# EAGLE design BMS Cell Charging Adapter rev2 (EAGLE 9.6.2)
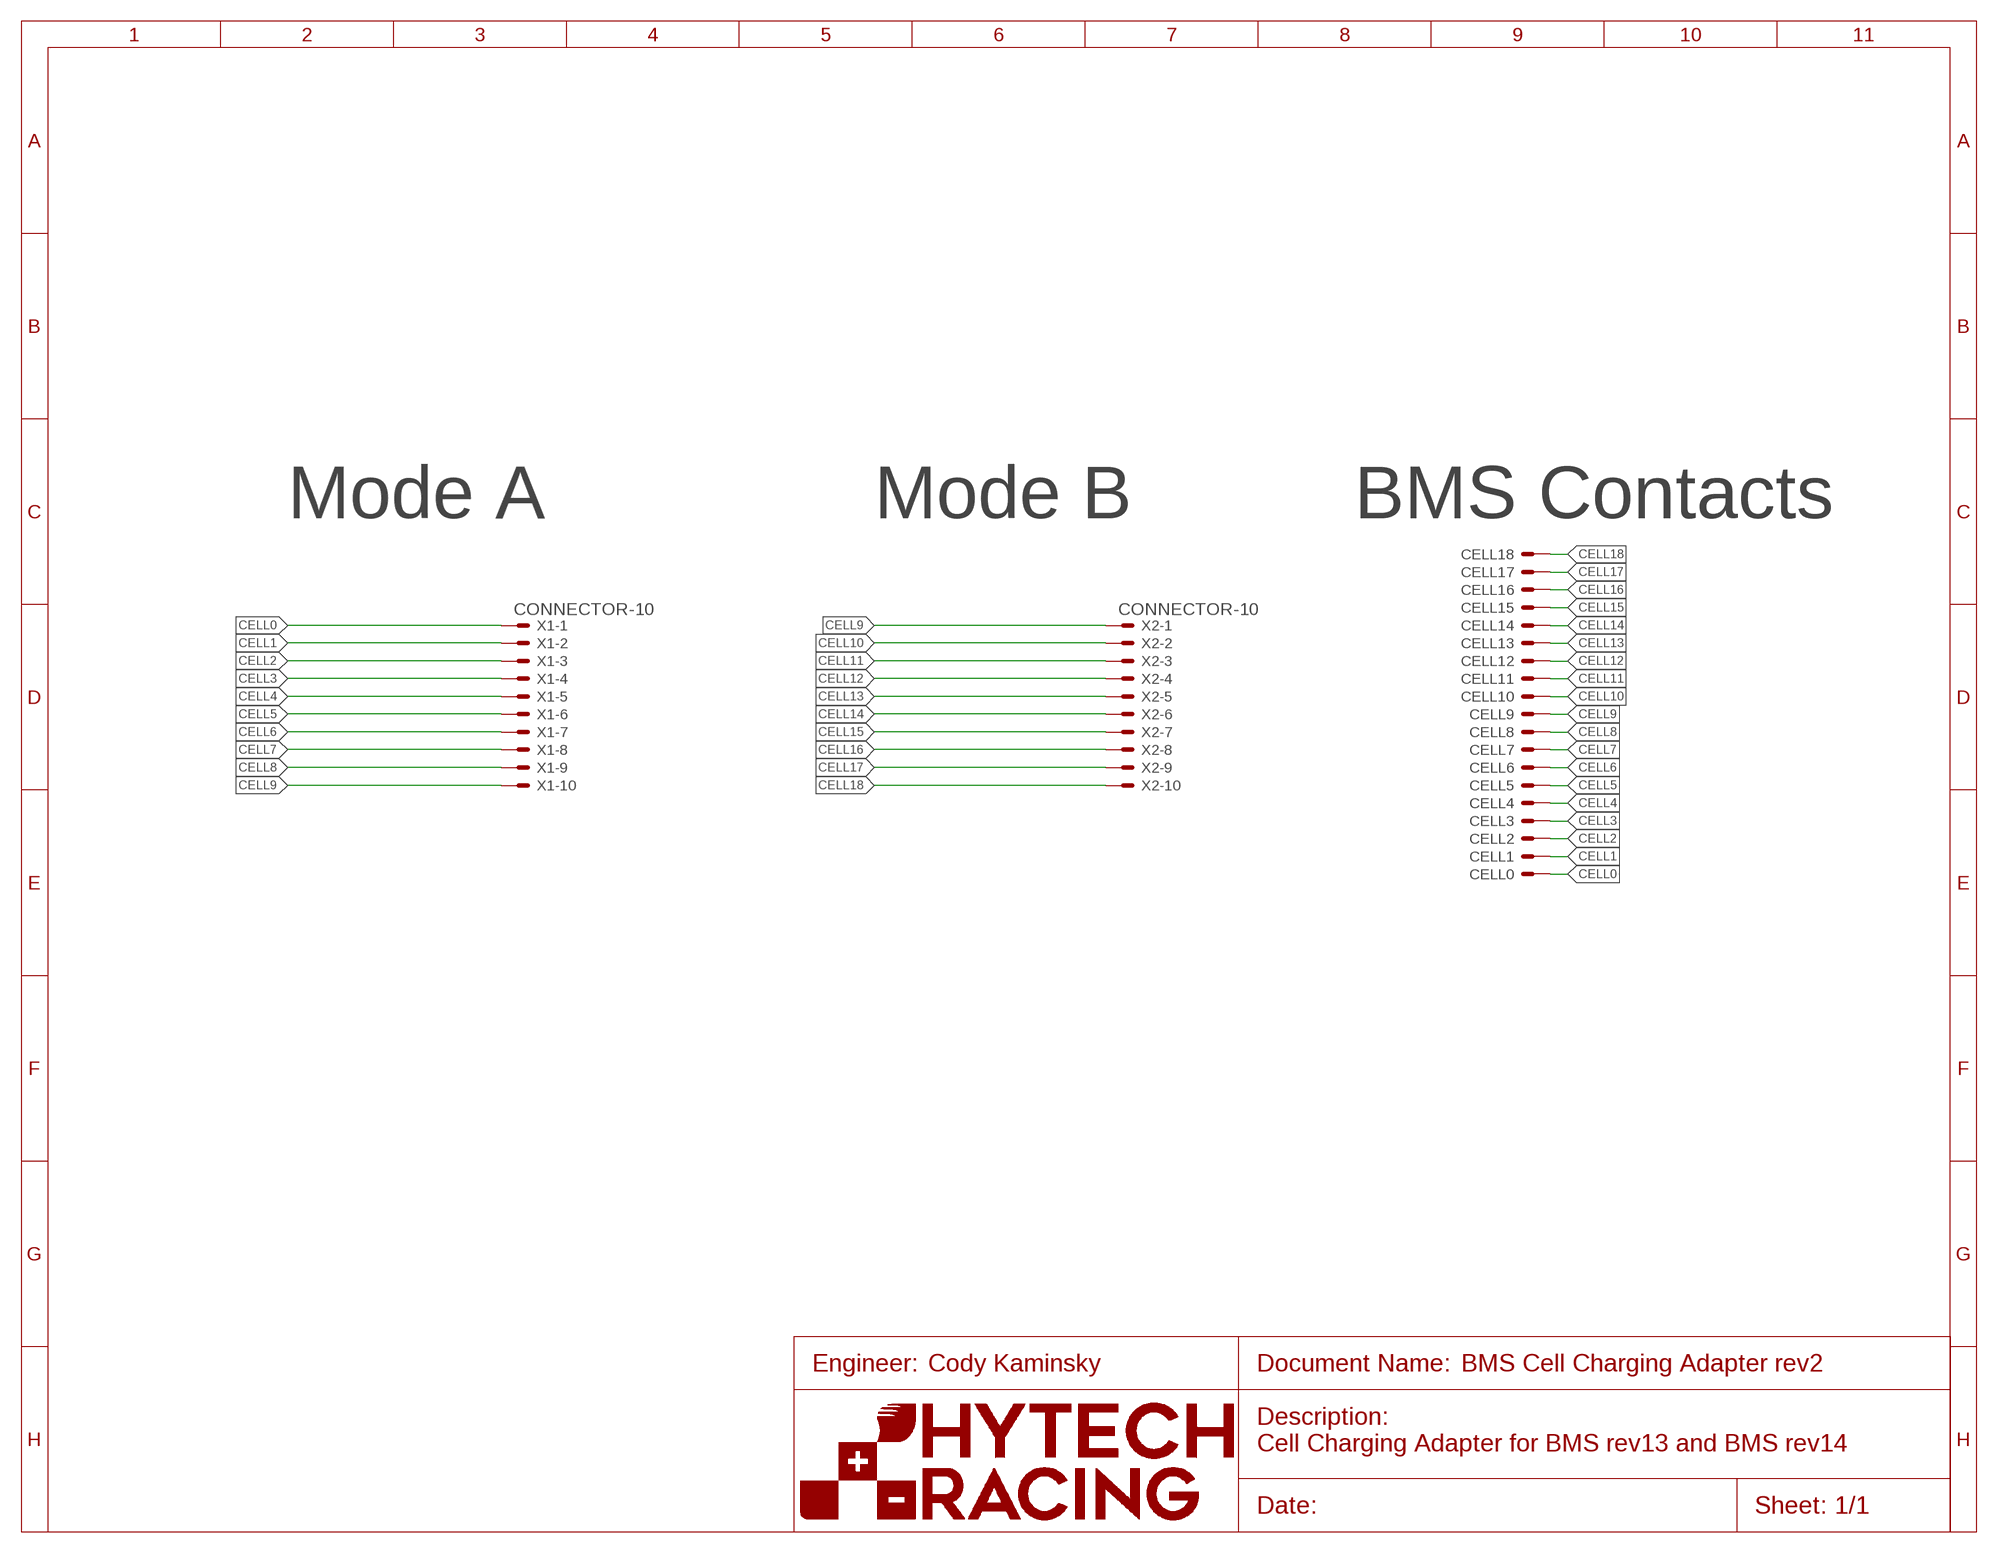
[diagram p0: schematic, sheet 1]
U$1 (FRAME_A): FRAME_DESCRIPTION: Default; ORIENTATION: LANDSCAPE; SIZE: A

## Parts
CELL0  BATTERY_SPRING_KEYSTONE5222  [KEYSTONE5222]
CELL1  BATTERY_SPRING_KEYSTONE5222  [KEYSTONE5222]
CELL2  BATTERY_SPRING_KEYSTONE5222  [KEYSTONE5222]
CELL3  BATTERY_SPRING_KEYSTONE5222  [KEYSTONE5222]
CELL4  BATTERY_SPRING_KEYSTONE5222  [KEYSTONE5222]
CELL5  BATTERY_SPRING_KEYSTONE5222  [KEYSTONE5222]
CELL6  BATTERY_SPRING_KEYSTONE5222  [KEYSTONE5222]
CELL7  BATTERY_SPRING_KEYSTONE5222  [KEYSTONE5222]
CELL8  BATTERY_SPRING_KEYSTONE5222  [KEYSTONE5222]
CELL9  BATTERY_SPRING_KEYSTONE5222  [KEYSTONE5222]
CELL10  BATTERY_SPRING_KEYSTONE5222  [KEYSTONE5222]
CELL11  BATTERY_SPRING_KEYSTONE5222  [KEYSTONE5222]
CELL12  BATTERY_SPRING_KEYSTONE5222  [KEYSTONE5222]
CELL13  BATTERY_SPRING_KEYSTONE5222  [KEYSTONE5222]
CELL14  BATTERY_SPRING_KEYSTONE5222  [KEYSTONE5222]
CELL15  BATTERY_SPRING_KEYSTONE5222  [KEYSTONE5222]
CELL16  BATTERY_SPRING_KEYSTONE5222  [KEYSTONE5222]
CELL17  BATTERY_SPRING_KEYSTONE5222  [KEYSTONE5222]
CELL18  BATTERY_SPRING_KEYSTONE5222  [KEYSTONE5222]
X1  CONNECTOR-10  [MINIFIT_5566-10]
X2  CONNECTOR-10  [MINIFIT_5566-10]

## Nets
CELL0: CELL0.P$1(S) X1.1
CELL1: CELL1.P$1(S) X1.2
CELL2: CELL2.P$1(S) X1.3
CELL3: CELL3.P$1(S) X1.4
CELL4: CELL4.P$1(S) X1.5
CELL5: CELL5.P$1(S) X1.6
CELL6: CELL6.P$1(S) X1.7
CELL7: CELL7.P$1(S) X1.8
CELL8: CELL8.P$1(S) X1.9
CELL9: CELL9.P$1(S) X1.10 X2.1
CELL10: CELL10.P$1(S) X2.2
CELL11: CELL11.P$1(S) X2.3
CELL12: CELL12.P$1(S) X2.4
CELL13: CELL13.P$1(S) X2.5
CELL14: CELL14.P$1(S) X2.6
CELL15: CELL15.P$1(S) X2.7
CELL16: CELL16.P$1(S) X2.8
CELL17: CELL17.P$1(S) X2.9
CELL18: CELL18.P$1(S) X2.10

## Notes on the sheet
- Mode A | Mode B | BMS Contacts
- Cody Kaminsky
- Cell Charging Adapter for BMS rev13 and BMS rev14

## Library data of the parts
CELL0 CELL1-CELL18 = HyTechDevices:BATTERY_SPRING: Keystone Electronics Battery Spring Contact Datasheet <http://keyelco.com/userAssets/file/M65p17.pdf>
X1 X2 = HyTechDevices:CONNECTOR-10: Mini-Fit Junior connector 10 pole Source: http://www.molex.com; OC_FARNELL: unknown; OC_NEWARK: unknown

## Board
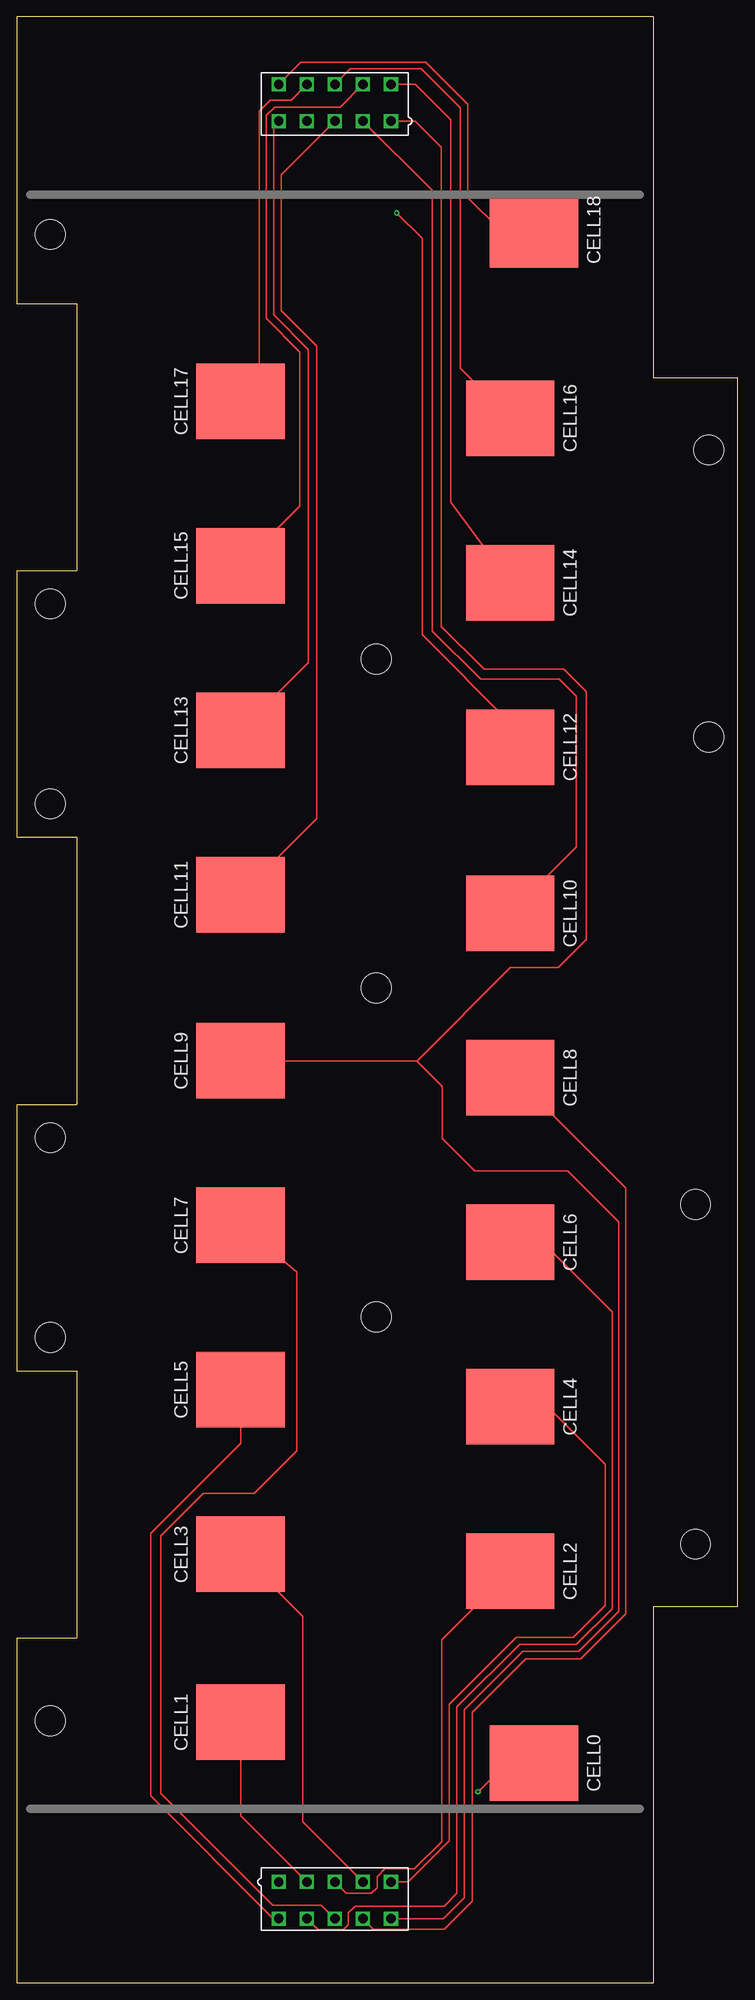
[diagram p1: board, top side]
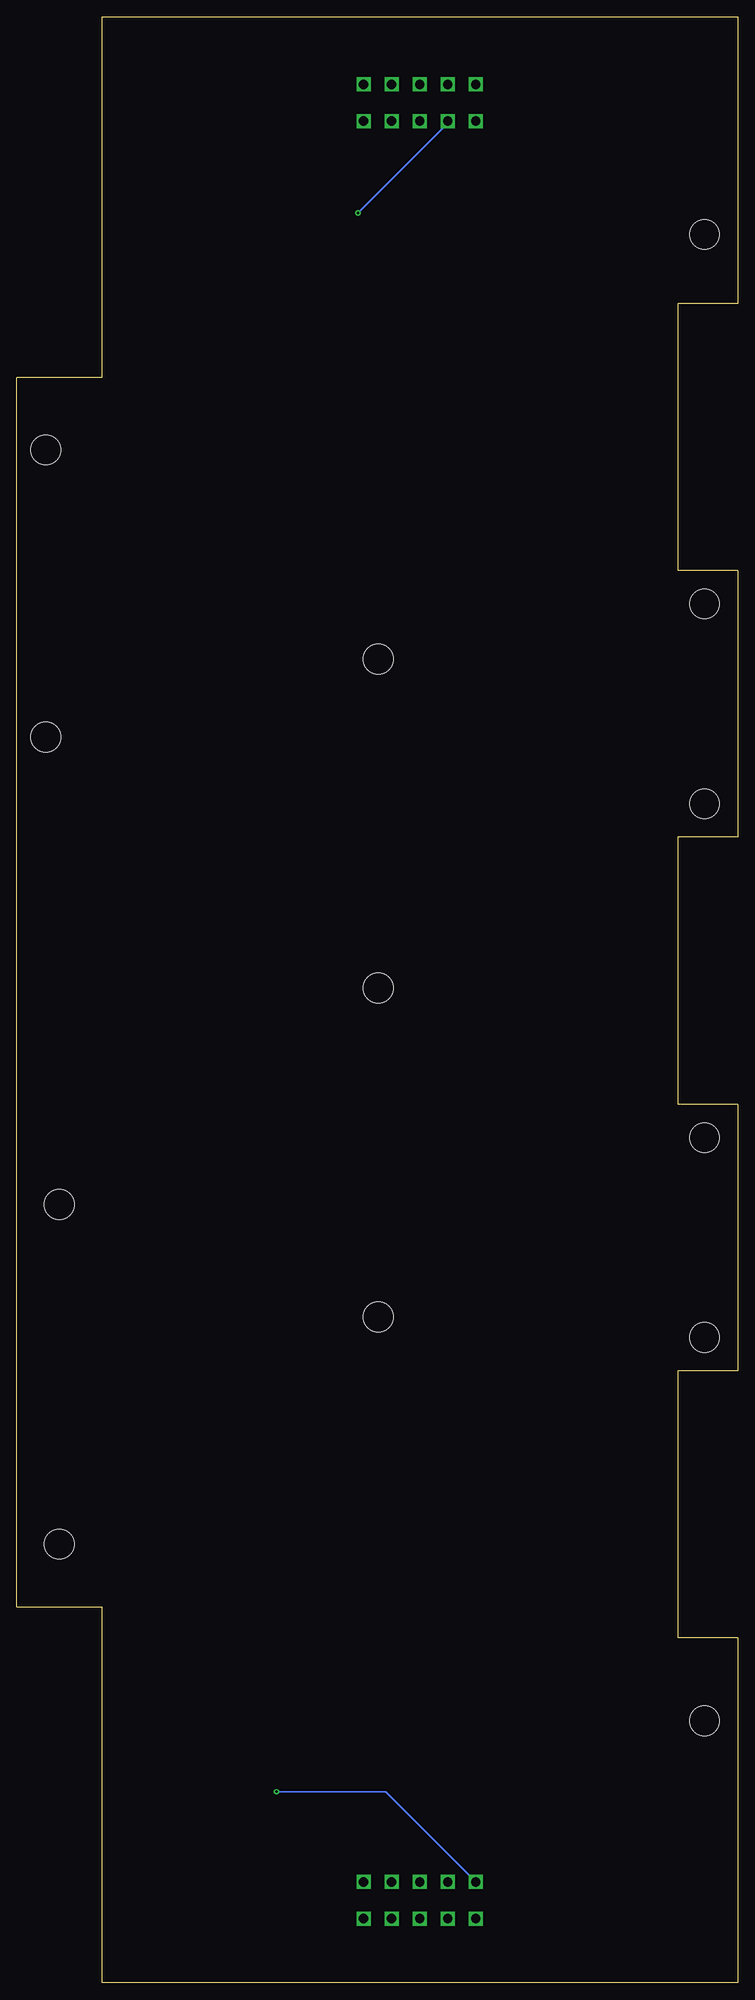
[diagram p2: board, bottom side, seen from below]

Size 108 x 294.49 mm. Coordinates in mm from the lower left corner, seen from the top.
Outline: 9,251.53 9,211.53 0,211.53 0,171.59 9,171.59 9,131.59 0,131.59 0,91.65 9,91.65 9,51.65 0,51.65 0,0 95.3,0 95.3,56.3 108,56.3 108,240.42 95.3,240.42 95.3,294.49 0,294.49 0,251.53 9,251.53
Copper layers (1*16): Top 0.035mm / dielectric 1.5mm / Bottom 0.035mm
Design rules "default": minimum track width 6mil, minimum drill 0.35mm, track to track 6mil, track to pad 6mil, pad to pad 6mil, via to via 6mil, smd to smd 6mil, copper to edge 40mil, drill to drill 6mil, minimum pad ring 10mil, minimum via ring 8mil, stop-mask expansion 4mil, vias tented up to drill 0mil, thermal gap 10mil

### Footprints (pad centres in the part's own frame; a part is rotated, then mirrored left to right if it is on the bottom)
KEYSTONE5222 = smd 11.303 x 13.208: P$1 0,0
M4_MOUNTING = hole 4.5: 0,0
MINIFIT_5566-10 = drill 1.4 square: 1 8.4,-2.75; 2 4.2,-2.75; 3 0,-2.75; 4 -4.2,-2.75; 5 -8.4,-2.75; 6 8.4,2.75; 7 4.2,2.75; 8 0,2.75; 9 -4.2,2.75; 10 -8.4,2.75

### Placement (x,y rotation side)
CELL0  77.47,32.93 270 top
CELL1  33.53,39.03 270 top
CELL2  73.91,61.64 270 top
CELL3  33.53,64.18 270 top
CELL4  73.91,86.27 270 top
CELL5  33.53,88.81 270 top
CELL6  73.91,110.91 270 top
CELL7  33.53,113.45 270 top
CELL8  73.91,135.55 270 top
CELL9  33.53,138.09 270 top
CELL10  73.91,160.19 270 top
CELL11  33.53,162.98 270 top
CELL12  73.91,185.08 270 top
CELL13  33.53,187.62 270 top
CELL14  73.91,209.72 270 top
CELL15  33.53,212.26 270 top
CELL16  73.91,234.36 270 top
CELL17  33.53,236.9 270 top
CELL18  77.47,262.55 270 top
U$2  [M4_MOUNTING]  5,261.88 0 top
U$3  [M4_MOUNTING]  5,206.54 0 top
U$4  [M4_MOUNTING]  5,176.59 0 top
U$5  [M4_MOUNTING]  5,126.59 0 top
U$6  [M4_MOUNTING]  5,96.65 0 top
U$7  [M4_MOUNTING]  5,39.27 0 top
U$8  [M4_MOUNTING]  101.65,65.71 0 top
U$9  [M4_MOUNTING]  101.65,116.59 0 top
U$10  [M4_MOUNTING]  103.65,186.59 0 top
U$11  [M4_MOUNTING]  103.65,229.59 0 top
U$12  [M4_MOUNTING]  53.85,198.29 0 top
U$13  [M4_MOUNTING]  53.85,149.01 0 top
U$14  [M4_MOUNTING]  53.85,99.74 0 top
X1  47.65,12.36 180 top
X2  47.65,281.6 0 top

### Tracks (layer width: path | path; a pad name or v marks a point on that pad's centre or on a via)
CELL0  (via drill 0.38)
  Top 0.254: v69.09,28.62 73.41,32.93 CELL0.P$1
  Bottom 0.254: X1.1 52.76,28.62 v69.09,28.62
CELL1
  Top 0.254: X1.2 33.53,25.03 CELL1.P$1
CELL2
  Top 0.254: 79,66.34 CELL2.P$1 63.63,51.35 63.63,21.12 59.56,17.06 55.12,17.06 53.98,15.92 53.98,14.27 53.09,13.38 49.38,13.38 X1.3
CELL3
  Top 0.254: 38.61,68.11 CELL3.P$1 42.81,54.9 42.81,24.15 X1.4
CELL4
  Top 0.254: CELL4.P$1 79.5,86.27 88.14,77.64 88.14,56.56 83.31,51.73 74.8,51.73 64.77,41.7 64.77,21.25 58.63,15.11 X1.5
CELL5
  Top 0.254: X1.6 38.44,9.61 20.07,27.98 20.07,67.35 33.53,80.81 CELL5.P$1
CELL6
  Top 0.254: CELL6.P$1 78.74,110.91 89.15,100.5 89.15,56.05 83.82,50.71 75.31,50.71 65.91,41.32 65.91,13.38 64.01,11.47 50.67,11.47 49.66,10.46 49.66,8.68 48.9,7.92 45.15,7.92 X1.7
CELL7
  Top 0.254: CELL7.P$1 41.91,106.47 41.91,79.67 35.56,73.32 27.94,73.32 21.59,66.97 21.59,28.36 38.31,11.64 45.62,11.64 X1.8
CELL8
  Top 0.254: CELL8.P$1 77.47,132.76 91.19,119.04 91.19,55.29 84.45,48.55 76.24,48.55 68.2,40.51 68.2,12.23 64.01,8.04 53.42,8.04 X1.9
CELL9
  Top 0.254: CELL9.P$1 59.89,138.09 | 59.89,138.09 63.7,134.28 63.7,126.46 68.58,121.58 82.55,121.58 90.17,113.96 90.17,55.67 84.14,49.64 75.75,49.64 67.04,40.92 67.04,12.77 63.88,9.61 X1.10 | 59.89,138.09 59.94,138.09 73.91,152.06 81.08,152.06 85.27,156.24 85.27,193.44 81.94,196.76 69.98,196.76 63.6,203.14 63.6,274.95 59.71,278.85 X2.1
CELL10
  Top 0.254: CELL10.P$1 83.82,170.09 83.82,192.7 81.28,195.24 69.47,195.24 62.23,202.48 62.23,265.09 62.23,265.78 62.23,268.47 X2.2
CELL11
  Top 0.254: CELL11.P$1 44.94,174.39 44.94,245.17 39.62,250.48 39.62,270.82 X2.3
CELL12  (via drill 0.38)
  Top 0.254: v56.9,265.09 60.71,261.28 60.71,201.91 73.91,188.7 CELL12.P$1
  Bottom 0.254: 56.78,265.09 v56.9,265.09 43.45,278.54 X2.4
CELL13
  Top 0.254: CELL13.P$1 43.69,197.78 43.69,244.64 38.49,249.84 38.49,278.09 X2.5
CELL14
  Top 0.254: CELL14.P$1 65.02,221.78 65.02,279.03 59.71,284.35 X2.6
CELL15
  Top 0.254: CELL15.P$1 42.42,221.15 42.42,244.26 37.34,249.34 37.34,279.69 38.61,280.97 48.47,280.97 X2.7
CELL16
  Top 0.254: CELL16.P$1 66.42,241.85 66.42,280.84 60.58,286.68 49.98,286.68 X2.8
CELL17
  Top 0.254: 36.07,239.44 CELL17.P$1 36.32,239.69 36.32,280.33 37.97,281.98 41.08,281.98 X2.9
CELL18
  Top 0.254: CELL18.P$1 72.39,262.55 67.53,267.41 67.53,281.38 61.24,287.67 42.57,287.67 X2.10

### Text on the board
tDocu: Mode B | Warning: Only install Mode A or Mode B connectors / DO NOT MIX | DANGER HIGH VOLTAGE | BMS Cell Charging Adapter 2020 rev2 | DANGER HIGH VOLTAGE | Warning: Only install Mode A or Mode B connectors / DO NOT MIX | Mode A